# EAGLE design MJ808 clone - rev.5 - TCAN334 - prod (EAGLE 9.6.2)
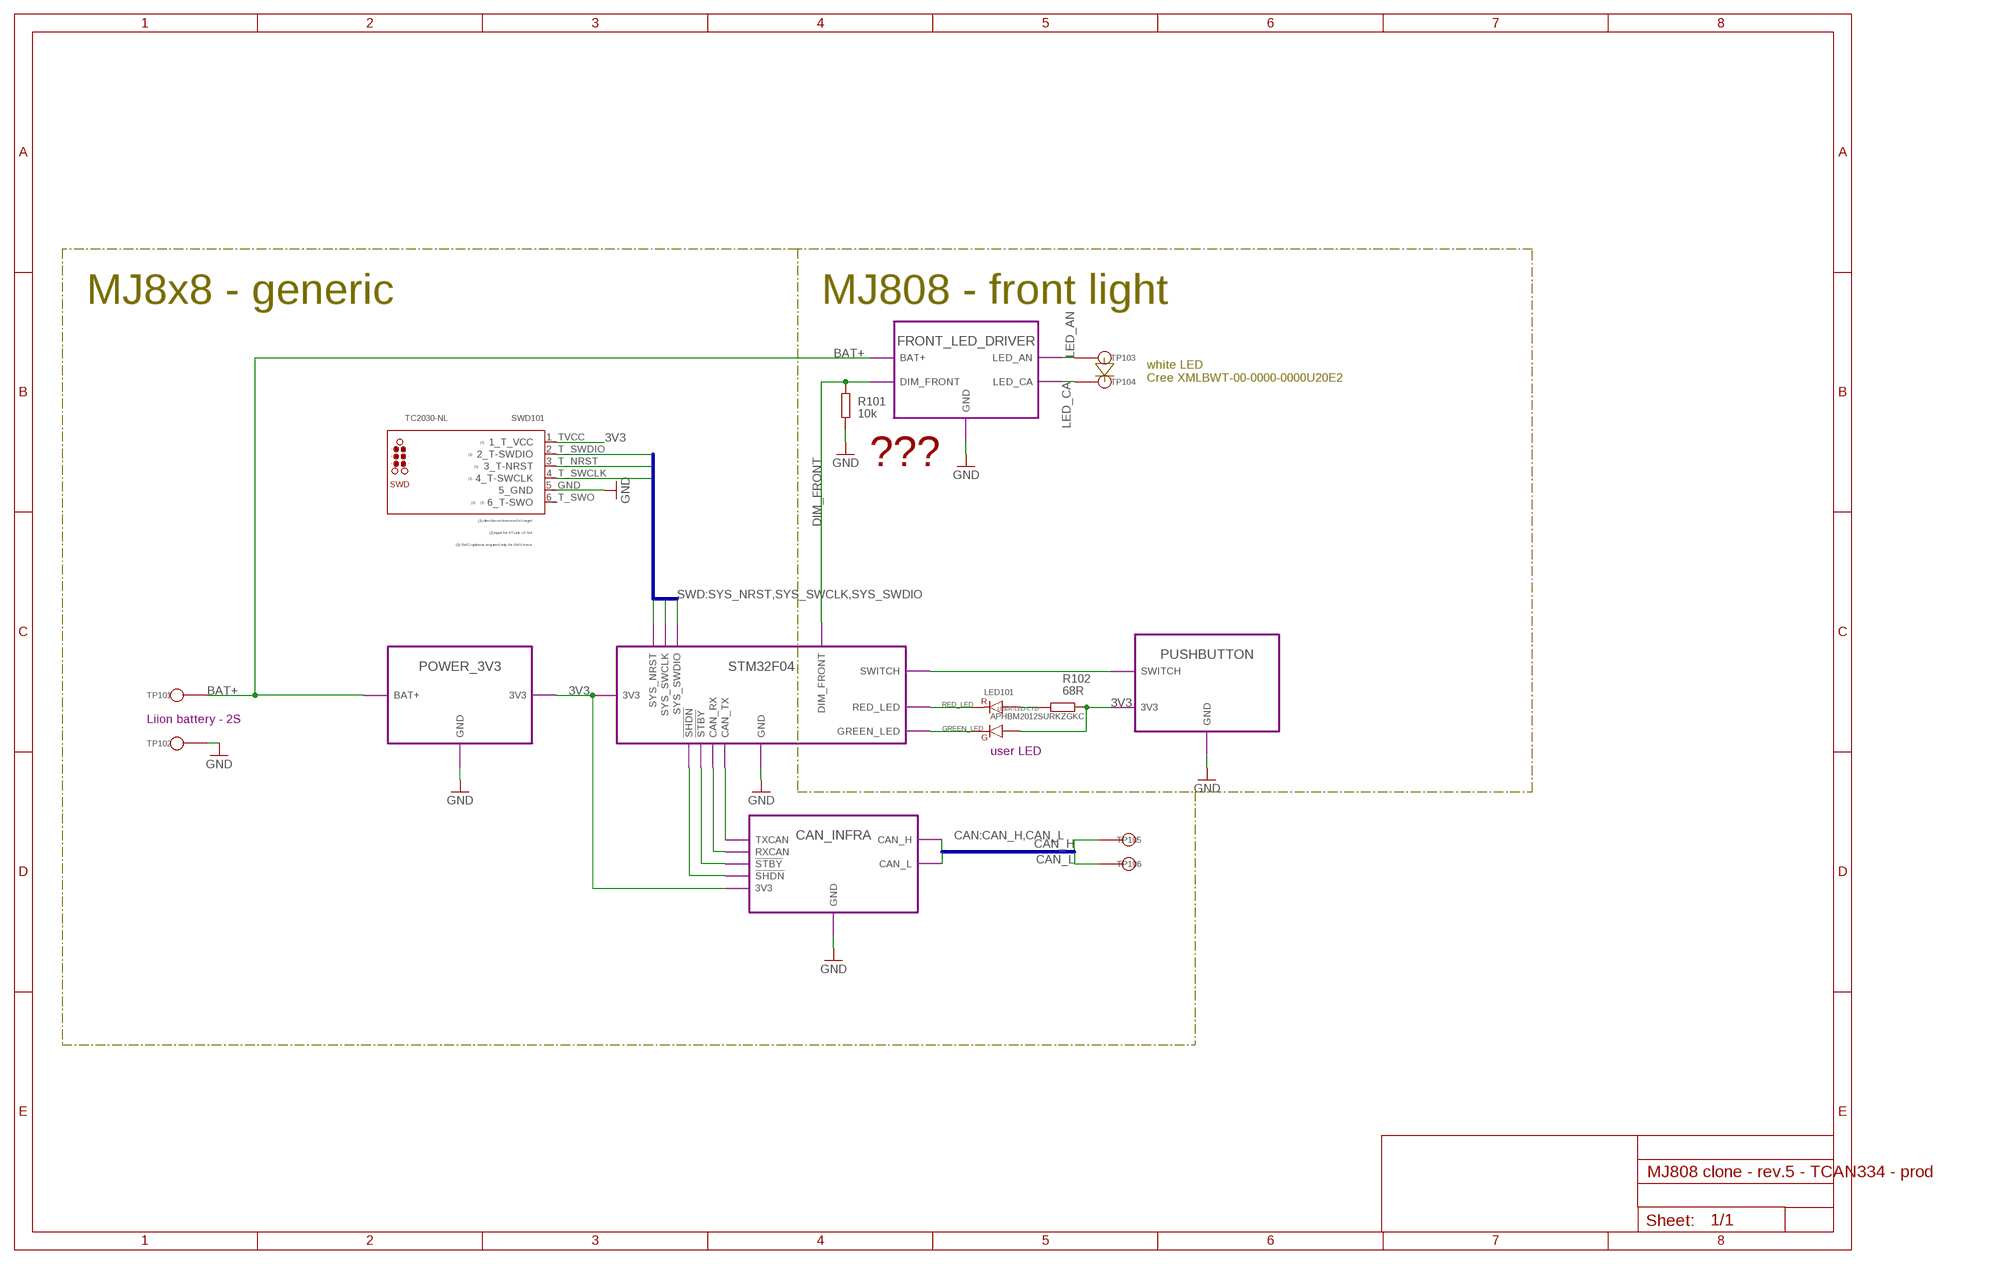
[diagram p0: schematic, sheet 1]

## Parts
LED101  APHBM2012SURKZGKC  APHBM2012LSURKZGKC  [SMD]
R101  10k  R-EU_R0402  [R0402]
R102  68R  R-EU_R0402  [R0402]
SWD101  TC2030-NL  TC2030  [TC2030-NL]
TP101  LiIon + Terminal  TP  [TH]
TP102  LiIon - Terminal  TP  [TH]
TP103  LED anode  TP  [TH]
TP104  LED cathode  TP  [TH]
TP105  CAN high  TP  [TH]
TP106  CAN low  TP  [TH]

## Module instances
POWER_3V3 = POWER_3V3 (part numbers offset by 200)
STM32F04 = STM32 (part numbers offset by 300)
CAN_INFRA = CAN_INFRA (part numbers offset by 400)
FRONT_LED_DRIVER = LED_DRIVER_FRONT (part numbers offset by 500)
PUSHBUTTON = PUSHBUTTON (part numbers offset by 600)

## Nets
3V3 [3V3]: LED101.4 R102.1 SWD101.1_TVCC(1_T_VCC) ; port POWER_3V3.3V3 STM32F04.3V3 CAN_INFRA.3V3 PUSHBUTTON.3V3
!SHDN!: port CAN_INFRA.!SHDN! STM32F04.!SHDN!
!STBY! [signal]: port CAN_INFRA.!STBY! STM32F04.!STBY!
BAT+ [BAT+]: TP101.TP$1 ; port POWER_3V3.BAT+ FRONT_LED_DRIVER.BAT+
CAN_H [signal]: TP105.TP$1 ; port CAN_INFRA.CAN_H
CAN_L [signal]: TP106.TP$1 ; port CAN_INFRA.CAN_L
CAN_RX [signal]: port CAN_INFRA.RXCAN STM32F04.CAN_RX
CAN_TX [signal]: port CAN_INFRA.TXCAN STM32F04.CAN_TX
DIM_FRONT [signal]: R101.2 ; port STM32F04.DIM_FRONT FRONT_LED_DRIVER.DIM_FRONT
GND: R101.1 SWD101.5_GND TP102.TP$1 ; port STM32F04.GND POWER_3V3.GND CAN_INFRA.GND FRONT_LED_DRIVER.GND PUSHBUTTON.GND
GREEN_LED [signal]: LED101.3 ; port STM32F04.GREEN_LED
LED_AN [BAT+]: TP103.TP$1 ; port FRONT_LED_DRIVER.LED_AN
LED_CA [BAT+]: TP104.TP$1 ; port FRONT_LED_DRIVER.LED_CA
RED_LED [signal]: LED101.2 ; port STM32F04.RED_LED
SWITCH: port STM32F04.SWITCH PUSHBUTTON.SWITCH
SYS_NRST [signal]: SWD101.3_T_NRST(3_T-NRST) ; port STM32F04.SYS_NRST
SYS_SWCLK [signal]: SWD101.4_T_SWCLK(4_T-SWCLK) ; port STM32F04.SYS_SWCLK
SYS_SWDIO [signal]: SWD101.2_T_SWDIO(2_T-SWDIO) ; port STM32F04.SYS_SWDIO
USER-LED-CTD [signal]: LED101.1 R102.2
Unconnected: SWD101.6_T_SWO(6_T-SWO)

## Buses
CAN:CAN_H,CAN_L
SWD:SYS_NRST,SYS_SWCLK,SYS_SWDIO

## Notes on the sheet
- MJ8x8 - generic | MJ808 - front light
- white LED
  Cree XMLBWT-00-0000-0000U20E2
- ???
- Liion battery - 2S
- user LED

## Library data of the parts
LED101 = APHBM2012LSURKZGKC:APHBM2012LSURKZGKC
R101 R102 = rcl:R-EU_: RESISTOR, European symbol; SPICEPREFIX: R
SWD101 = tag-connect:TC2030: TC2030 pad no. Function STLink v3 CN1 pin no. Function 1 Reserved (1) 2 Reserved (1) 1 T_Vcc 3 T_Vcc (2) 2 T_SWDIO 4 T_JTMS/T_SWDIO 5 GND 4 T_SWCLK 6 T_JCLK / T_SWCLK 5 GND 7 GND 6 8 T_JTDO / T_SWO (3) 9 T_JRCLK (4) / NC (5) 10 T_JTDI / NC (5) 11 GNDDetect (6) 3 T_NRST 12 T_NRST 13 T_VCP_RX (7) 14 T_VCP_TX (2) (1) Do not connect to the target (2) Input for STLINK-V3SET (3) SWO is optional, required only for Serial Wire Viewer (SWV) trace (4) Optional loopback of T_JCLK on the target side, required if loopback is removed on the STLINK-V3SET side (5) NC means not required for the SWD connection (6) Tied to GND by STLINK-V3SET firmware; may be used by the target for detection of the tool (7) Output for STLINK-V3SET
TP101-TP106 = signal testpoint:TP

## Module POWER_3V3
Ports: GND(pwr) BAT+(pwr) 3V3(pwr)
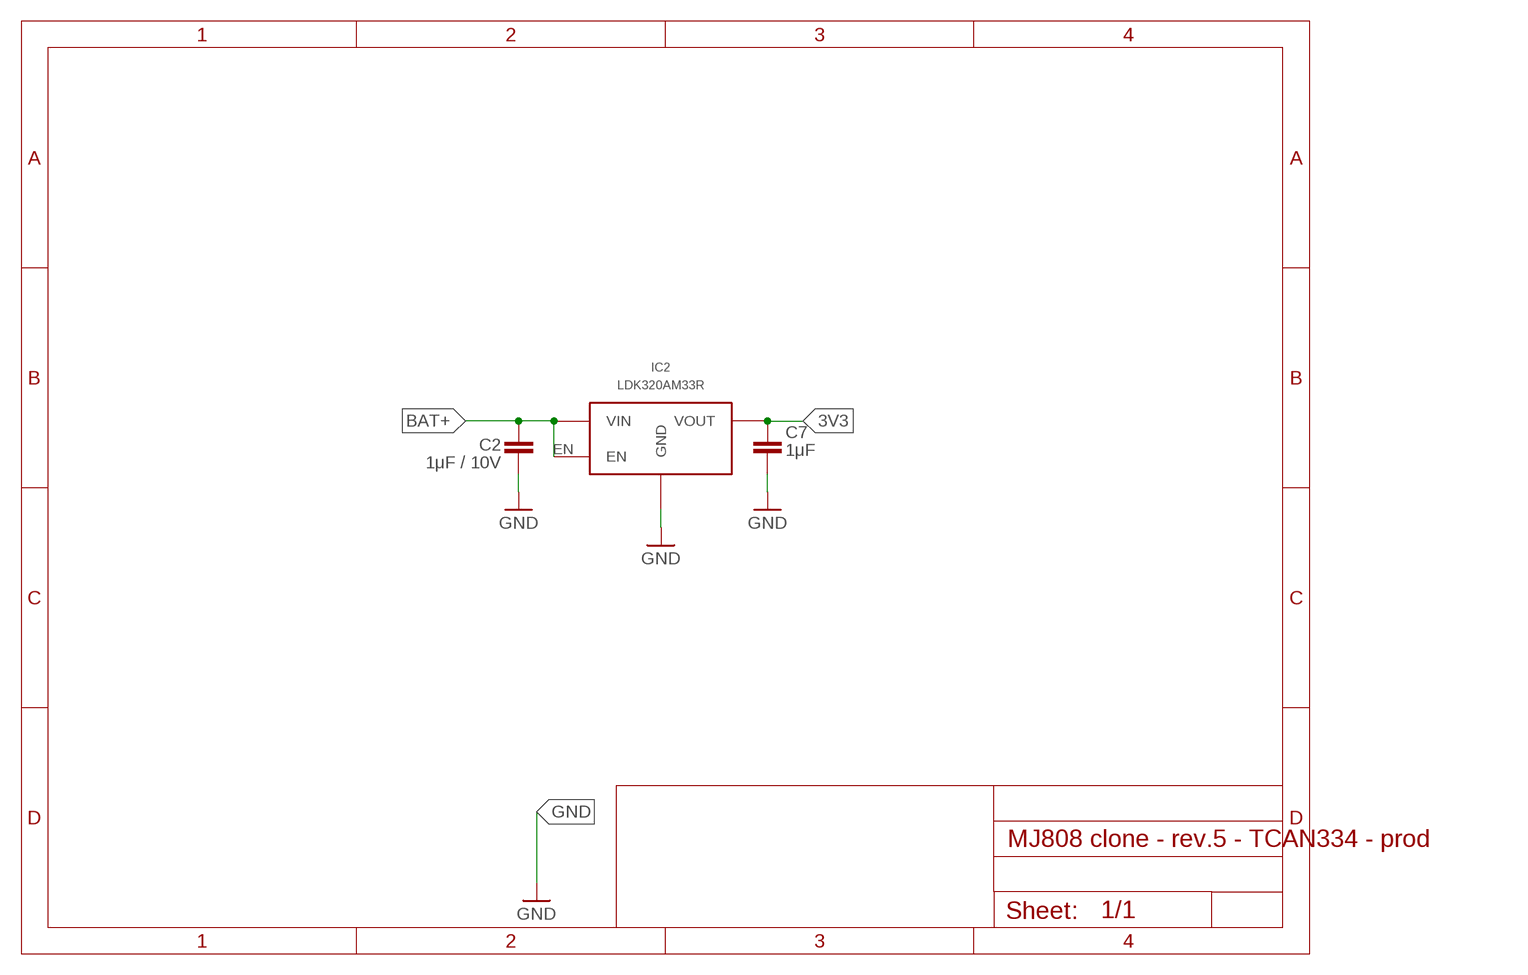
[diagram p1: schematic, module POWER_3V3, sheet 1]

### Parts
C2  1μF / 10V  C-EUC0402  [C0402]
C7  1μF  C-EUC0402  [C0402]
IC2  LDK320AM33R  LDK320SOT-23-5L  [SOT-23-5L]

### Nets
3V3 [3V3]: C7.2 IC2.OUT(VOUT)
BAT+ [BAT+]: C2.1 IC2.EN IC2.IN(VIN)
GND: C2.2 C7.1 IC2.GND

### Library data of the parts
C2 C7 = rcl:C-EU: CAPACITOR, European symbol; SPICEPREFIX: C
IC2 = LDK320 5V LDO:LDK320

## Module STM32
Ports: GND(pwr) 3V3(pwr) SYS_NRST(in) SYS_SWCLK(io) SYS_SWDIO(io) CAN_RX(in) CAN_TX(out) !STBY!(out) SWITCH(in) GREEN_LED(hiz) RED_LED(hiz) DIM_FRONT(out) !SHDN!(out)
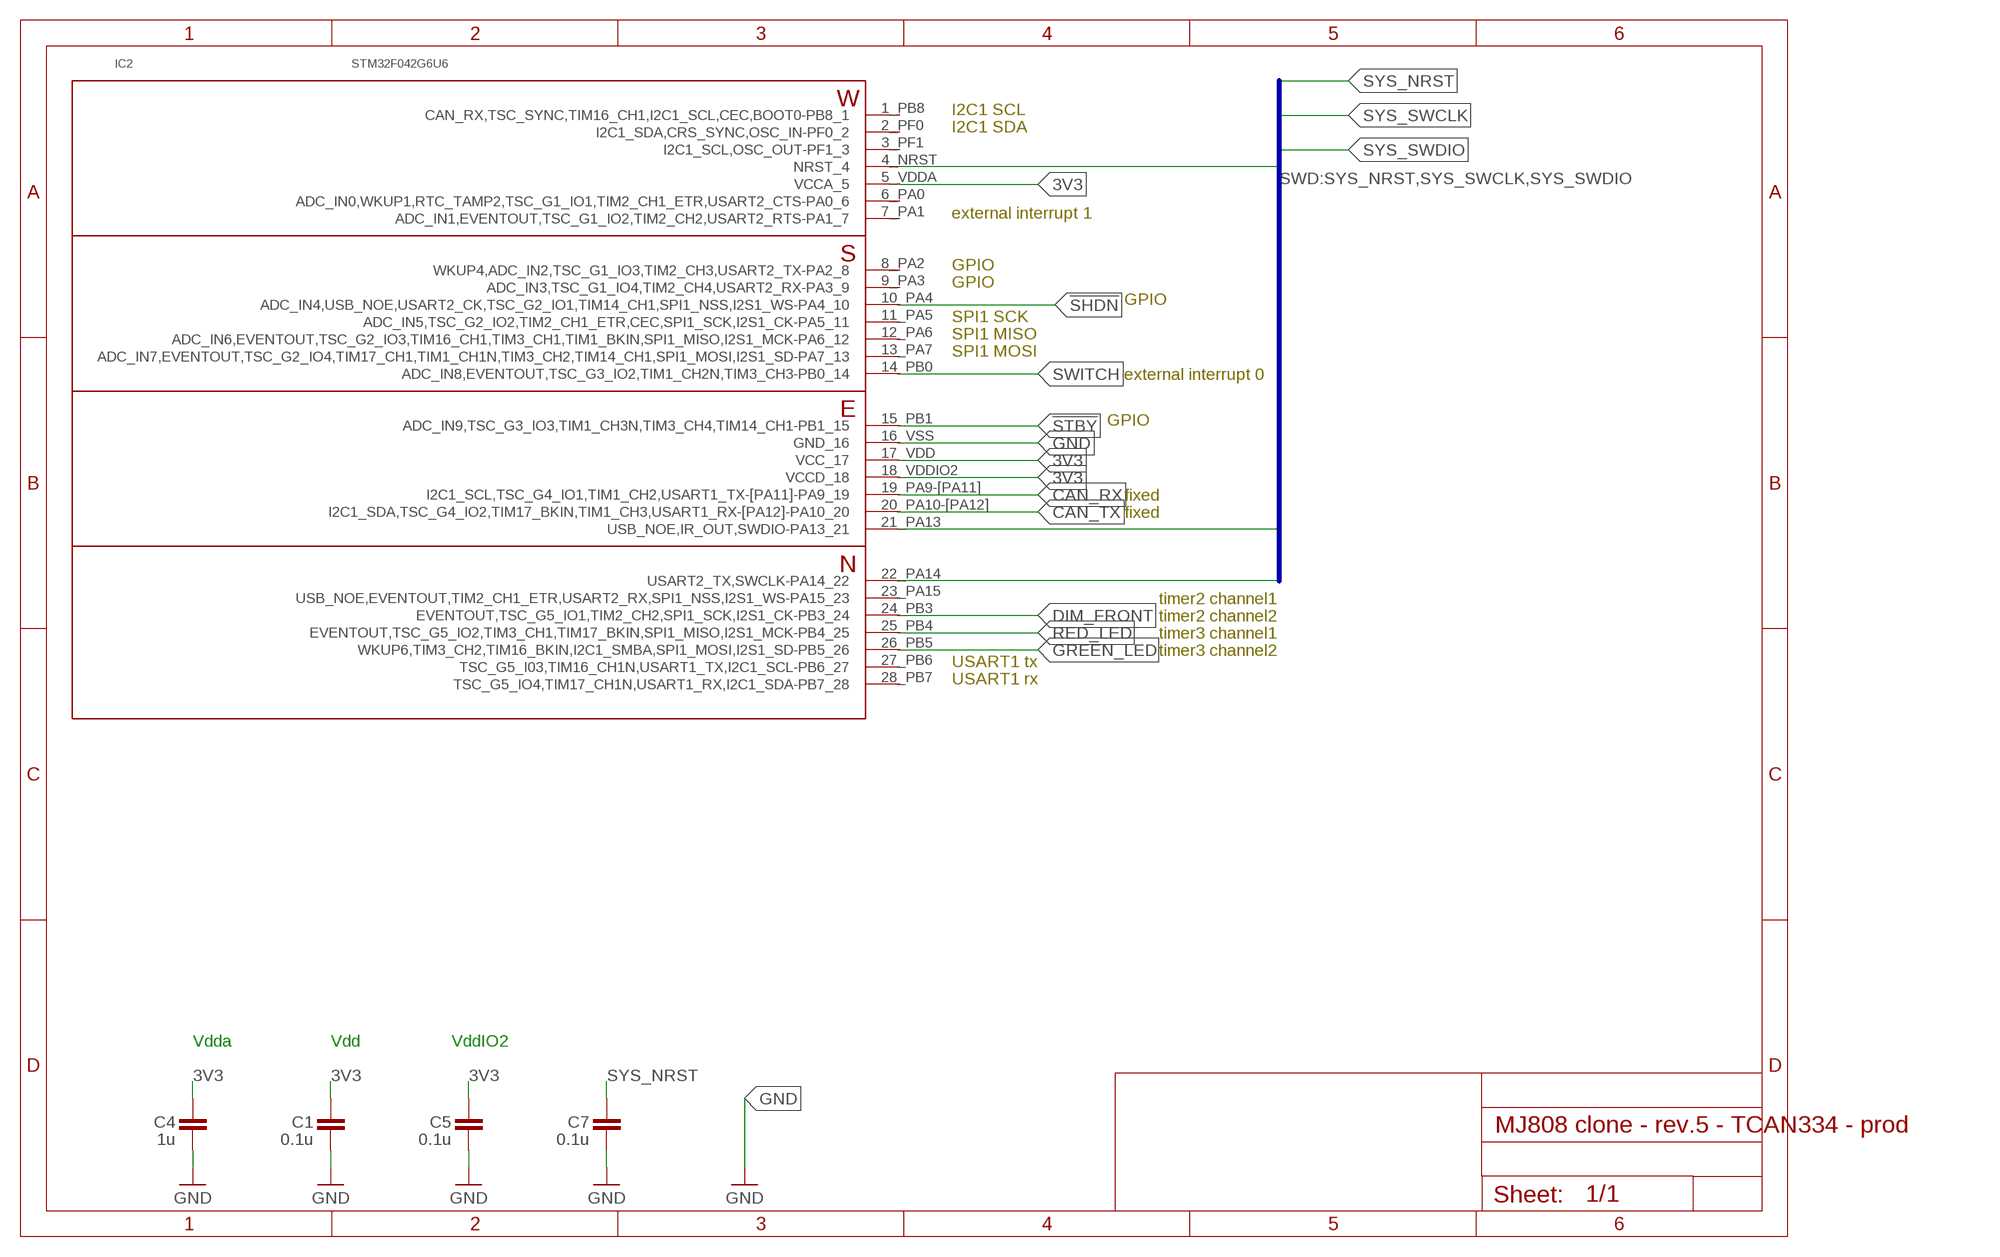
[diagram p2: schematic, module STM32, sheet 1]

### Parts
C1  0.1u  C-EUC0402  [C0402]
C4  1u  C-EUC0402  [C0402]
C5  0.1u  C-EUC0402  [C0402]
C7  0.1u  C-EUC0402  [C0402]
IC2  STM32F042G6U6  STM32F042G6  [UFQFPN-28]

### Nets
3V3 [3V3]: C1.2 C4.2 C5.2 IC2.5_VDDA(VCCA_5) IC2.17_VDD(VCC_17) IC2.18_VDDIO2(VCCD_18)
!SHDN!: IC2.10_PA4(ADC_IN4,USB_NOE,USART2_CK,TSC_G2_IO1,TIM14_CH1,SPI1_NSS,I2S1_WS-PA4_10)
!STBY!: IC2.15_PB1(ADC_IN9,TSC_G3_IO3,TIM1_CH3N,TIM3_CH4,TIM14_CH1-PB1_15)
CAN_RX: IC2.19_PA9-[PA11](I2C1_SCL,TSC_G4_IO1,TIM1_CH2,USART1_TX-[PA11]-PA9_19)
CAN_TX: IC2.20_PA10-[PA12](I2C1_SDA,TSC_G4_IO2,TIM17_BKIN,TIM1_CH3,USART1_RX-[PA12]-PA10_20)
DIM_FRONT: IC2.24_PB3(EVENTOUT,TSC_G5_IO1,TIM2_CH2,SPI1_SCK,I2S1_CK-PB3_24)
GND: C1.1 C4.1 C5.1 C7.1 IC2.16_VSS(GND_16)
GREEN_LED: IC2.26_PB5(WKUP6,TIM3_CH2,TIM16_BKIN,I2C1_SMBA,SPI1_MOSI,I2S1_SD-PB5_26)
RED_LED: IC2.25_PB4(EVENTOUT,TSC_G5_IO2,TIM3_CH1,TIM17_BKIN,SPI1_MISO,I2S1_MCK-PB4_25)
SWITCH: IC2.14_PB0(ADC_IN8,EVENTOUT,TSC_G3_IO2,TIM1_CH2N,TIM3_CH3-PB0_14)
SYS_NRST: C7.2 IC2.4_NRST(NRST_4)
SYS_SWCLK: IC2.22_PA14(USART2_TX,SWCLK-PA14_22)
SYS_SWDIO: IC2.21_PA13(USB_NOE,IR_OUT,SWDIO-PA13_21)
Unconnected: IC2.1_PB8(CAN_RX,TSC_SYNC,TIM16_CH1,I2C1_SCL,CEC,BOOT0-PB8_1) IC2.2_PF0(I2C1_SDA,CRS_SYNC,OSC_IN-PF0_2) IC2.3_PF1(I2C1_SCL,OSC_OUT-PF1_3) IC2.6_PA0(ADC_IN0,WKUP1,RTC_TAMP2,TSC_G1_IO1,TIM2_CH1_ETR,USART2_CTS-PA0_6) IC2.7_PA1(ADC_IN1,EVENTOUT,TSC_G1_IO2,TIM2_CH2,USART2_RTS-PA1_7) IC2.8_PA2(WKUP4,ADC_IN2,TSC_G1_IO3,TIM2_CH3,USART2_TX-PA2_8) IC2.9_PA3(ADC_IN3,TSC_G1_IO4,TIM2_CH4,USART2_RX-PA3_9) IC2.11_PA5(ADC_IN5,TSC_G2_IO2,TIM2_CH1_ETR,CEC,SPI1_SCK,I2S1_CK-PA5_11) IC2.12_PA6(ADC_IN6,EVENTOUT,TSC_G2_IO3,TIM16_CH1,TIM3_CH1,TIM1_BKIN,SPI1_MISO,I2S1_MCK-PA6_12) IC2.13_PA7(ADC_IN7,EVENTOUT,TSC_G2_IO4,TIM17_CH1,TIM1_CH1N,TIM3_CH2,TIM14_CH1,SPI1_MOSI,I2S1_SD-PA7_13) IC2.23_PA15(USB_NOE,EVENTOUT,TIM2_CH1_ETR,USART2_RX,SPI1_NSS,I2S1_WS-PA15_23) IC2.27_PB6(TSC_G5_I03,TIM16_CH1N,USART1_TX,I2C1_SCL-PB6_27) IC2.28_PB7(TSC_G5_IO4,TIM17_CH1N,USART1_RX,I2C1_SDA-PB7_28)

### Buses
SWD:SYS_NRST,SYS_SWCLK,SYS_SWDIO

### Notes on the sheet
- I2C1 SCL
- I2C1 SDA
- external interrupt 1
- GPIO
- GPIO
- GPIO
- SPI1 SCK
- SPI1 MISO
- SPI1 MOSI
- external interrupt 0
- GPIO
- fixed
- fixed
- timer2 channel1
- timer2 channel2
- timer3 channel1
- timer3 channel2
- USART1 tx
- USART1 rx
- Vdda | Vdd | VddIO2

### Library data of the parts
C1 C4 C5 C7 = rcl:C-EU: CAPACITOR, European symbol; SPICEPREFIX: C
IC2 = STM32F042G6:STM32F042G6

## Module CAN_INFRA
Ports: GND(pwr) 3V3(pwr) CAN_H(io) CAN_L(io) TXCAN(in) RXCAN(out) !STBY!(in) !SHDN!(in)
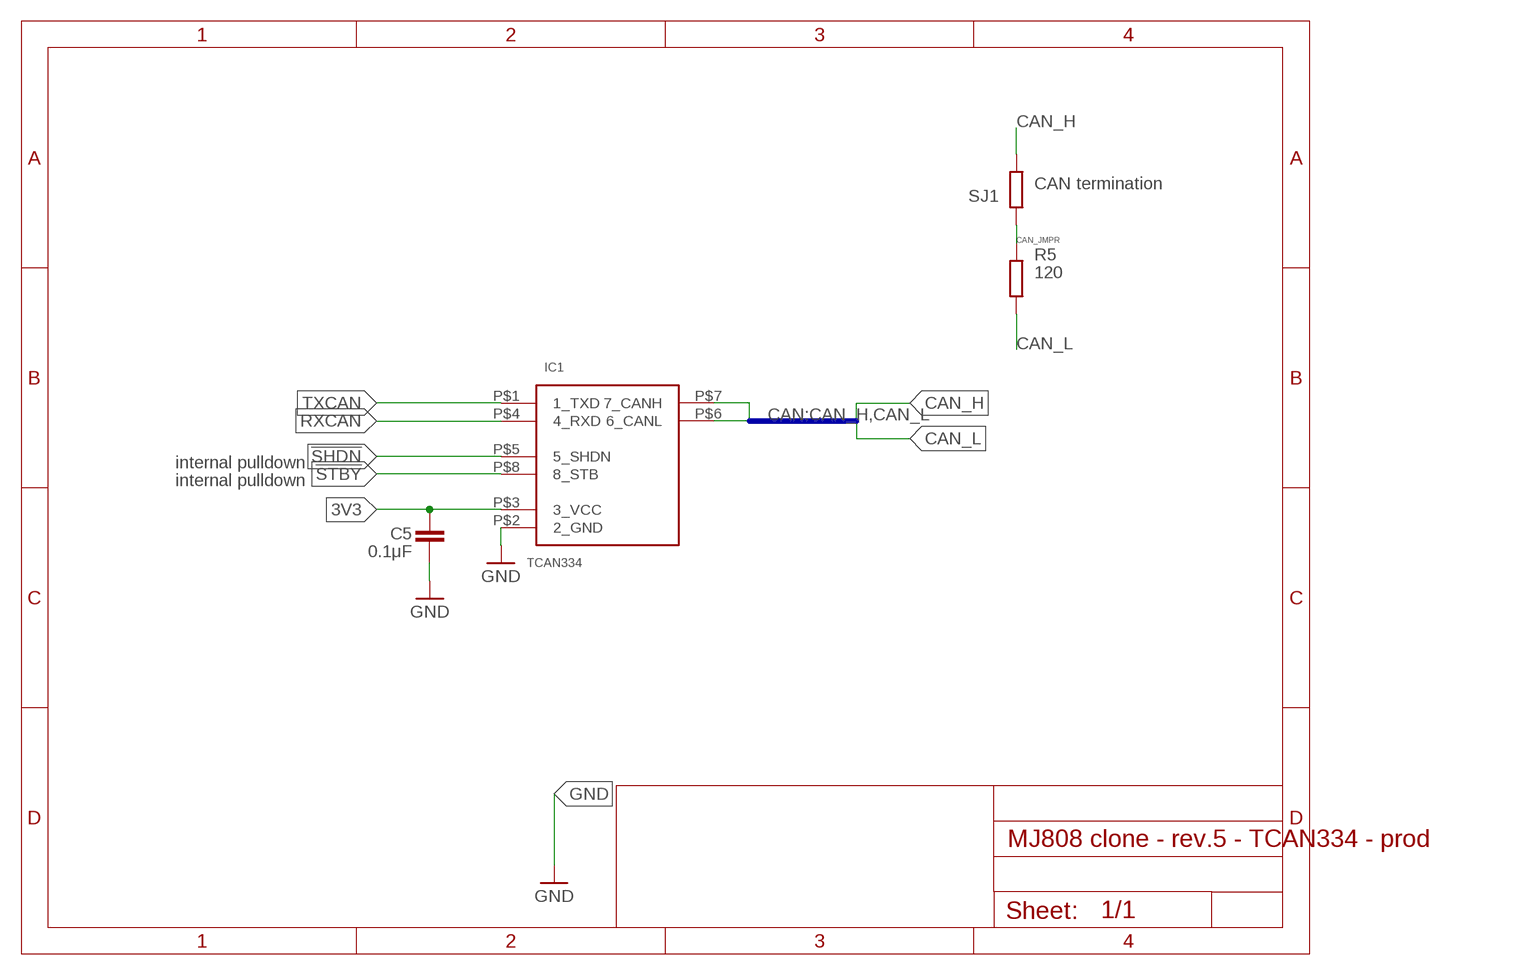
[diagram p3: schematic, module CAN_INFRA, sheet 1]

### Parts
C5  0.1μF  C-EUC0402  [C0402]
IC1  TCAN334  CAN33X  [SOT23-8]
R5  120  R-EU_R0805  [R0805]
SJ1  CAN termination  R-EU_R0402  [R0402]

### Nets
3V3 [3V3]: C5.1 IC1.P$3(3_VCC)
!SHDN!: IC1.P$5(5_SHDN)
!STBY! [signal]: IC1.P$8(8_STB)
CAN_H: IC1.P$7(7_CANH) SJ1.2
CAN_JMPR [signal]: R5.2 SJ1.1
CAN_L: IC1.P$6(6_CANL) R5.1
GND: C5.2 IC1.P$2(2_GND)
RXCAN [signal]: IC1.P$4(4_RXD)
TXCAN [signal]: IC1.P$1(1_TXD)

### Buses
CAN:CAN_H,CAN_L

### Notes on the sheet
- internal pulldown
- internal pulldown

### Library data of the parts
C5 = rcl:C-EU: CAPACITOR, European symbol; SPICEPREFIX: C
IC1 = TCAN33x - 3.3V CAN Transciever:CAN33X
R5 SJ1 = rcl:R-EU_: RESISTOR, European symbol; SPICEPREFIX: R

## Module LED_DRIVER_FRONT
Ports: GND(pwr) LED_AN(pwr) LED_CA(pwr) DIM_FRONT(in) BAT+(pwr)
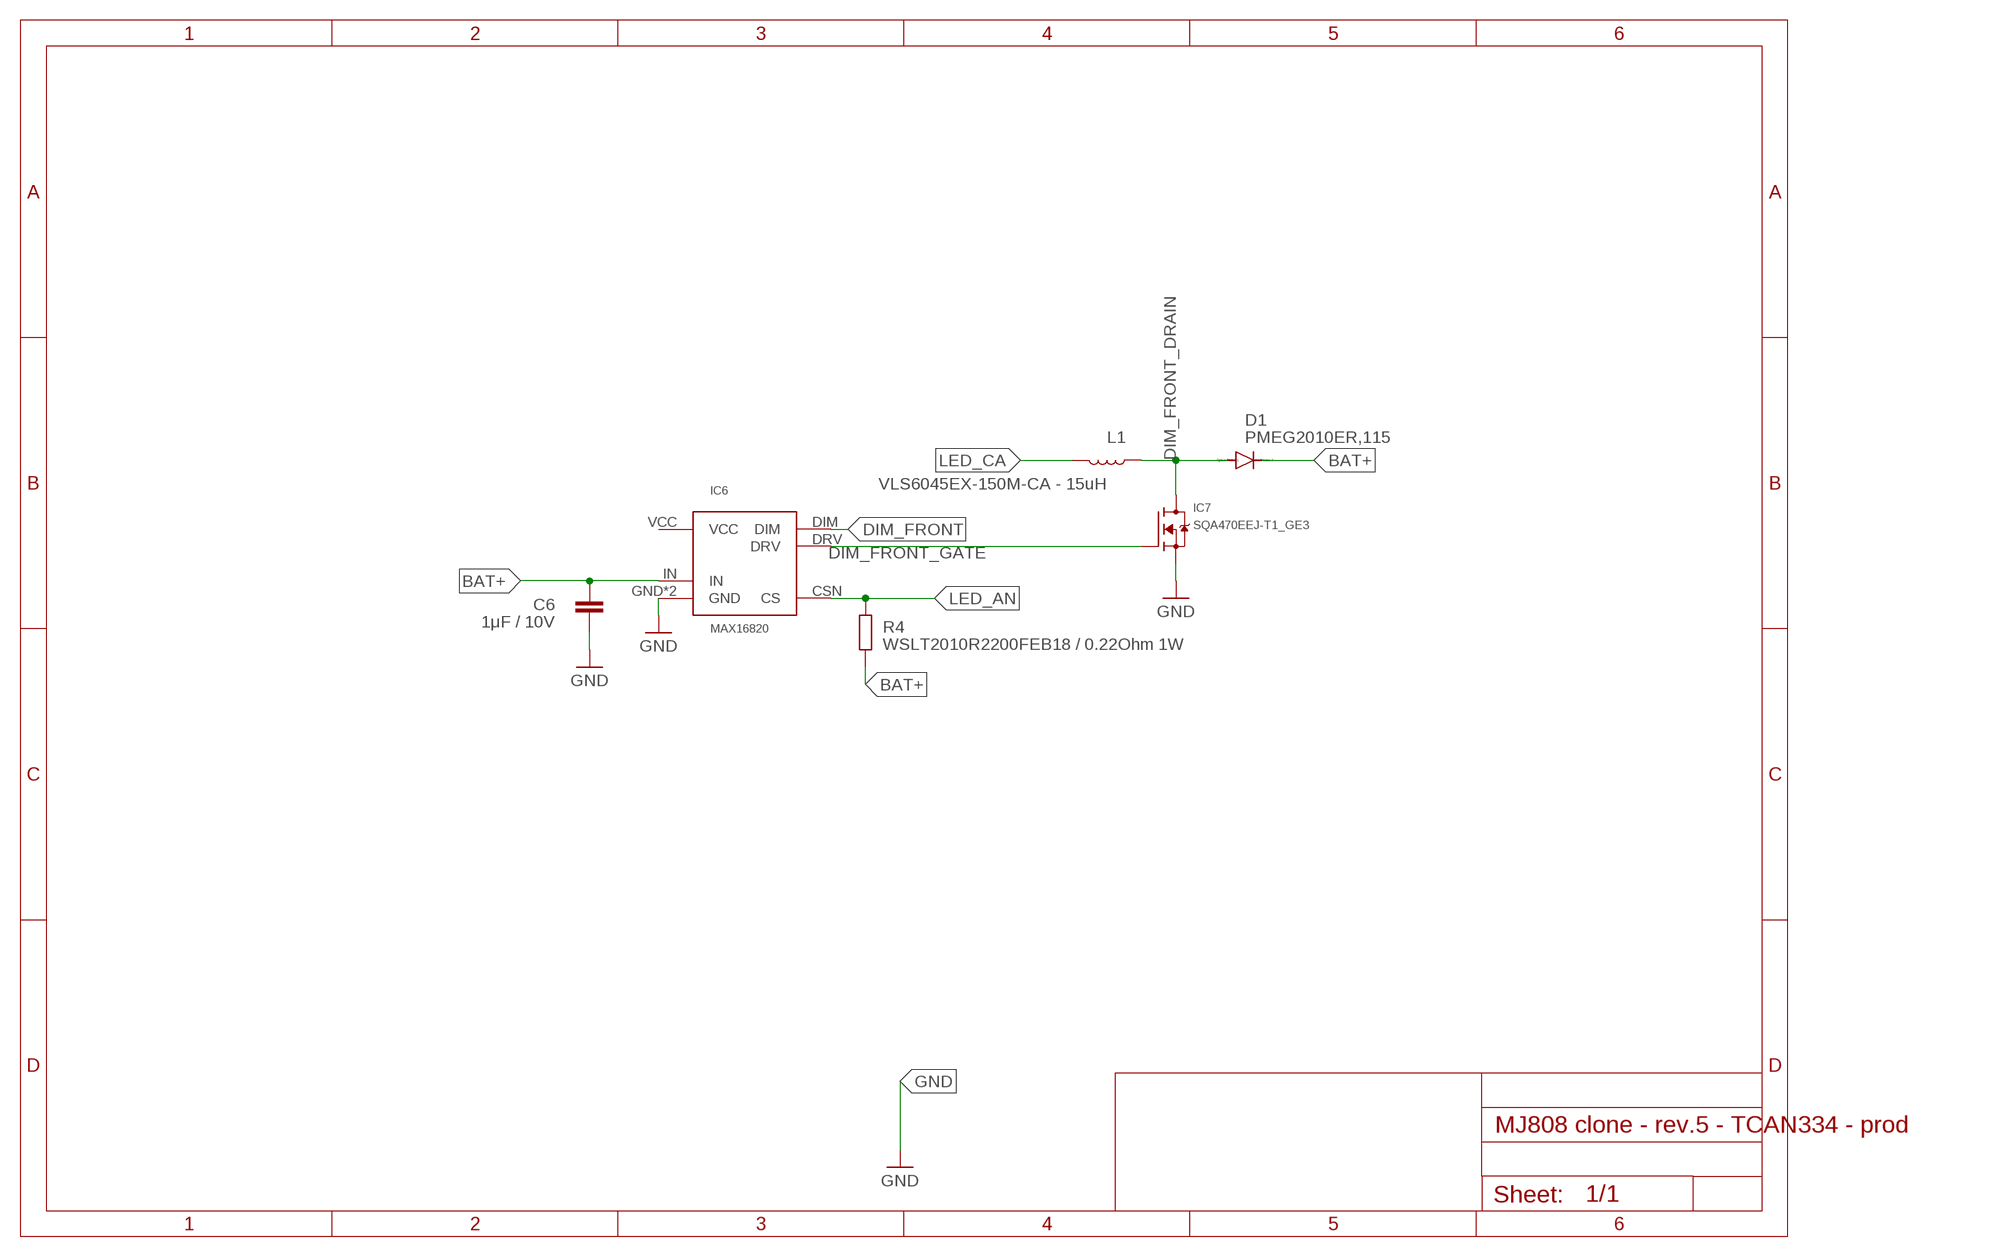
[diagram p4: schematic, module LED_DRIVER_FRONT, sheet 1]

### Parts
C6  1μF / 10V  C-EUC0402  [C0402]
D1  PMEG2010ER,115  DIODE-SOD123  [SOD123]
IC6  MAX16820  [TDFN-6-EP]
IC7  SQA470EEJ-T1_GE3  SIA456DJ  [SC-70-6]
L1  VLS6045EX-150M-CA - 15uH  INDUCTOR-SRN6045-33UH  [SRN6045]
R4  WSLT2010R2200FEB18 / 0.22Ohm 1W  R-EU_R2010  [R2010]

### Nets
BAT+ [BAT+]: C6.1 D1.C IC6.IN R4.2
DIM_FRONT [signal]: IC6.DIM
DIM_FRONT_DRAIN [signal]: D1.A IC7.1D(D) IC7.2D(D) IC7.5D(D) IC7.6D(D) IC7.D L1.1
DIM_FRONT_GATE [signal]: IC6.DRV IC7.3G(G)
GND: C6.2 IC6.GND IC6.GND1(GND) IC7.4S(S) IC7.S
LED_AN [BAT+]: IC6.CSN(CS) R4.1
LED_CA [BAT+]: L1.2

### Power pins joined to a net without a drawn wire
VCC: IC6.VCC

### Library data of the parts
C6 = rcl:C-EU: CAPACITOR, European symbol; SPICEPREFIX: C
D1 = diode:DIODE-: DIODE
IC6 = MAX16820 LED Driver, constant current:MAX16820
IC7 = SIA456DJ-T1-GE3  N-Fet:SIA456DJ
L1 = SparkFun-Coils:INDUCTOR: Inductors Resist changes in electrical current. Basically a coil of wire. SparkFun Products: SparkFun Load Cell Amplifier - HX711 <https://www.sparkfun.com/products/13879> IOIO-OTG - V2.2 <https://www.sparkfun.com/products/13613>; PROD_ID: NDUC-11627; VALUE: 33µH/±20%/1.4A
R4 = rcl:R-EU_: RESISTOR, European symbol; SPICEPREFIX: R

## Module PUSHBUTTON
Ports: SWITCH(out) GND(pwr) 3V3(pwr)
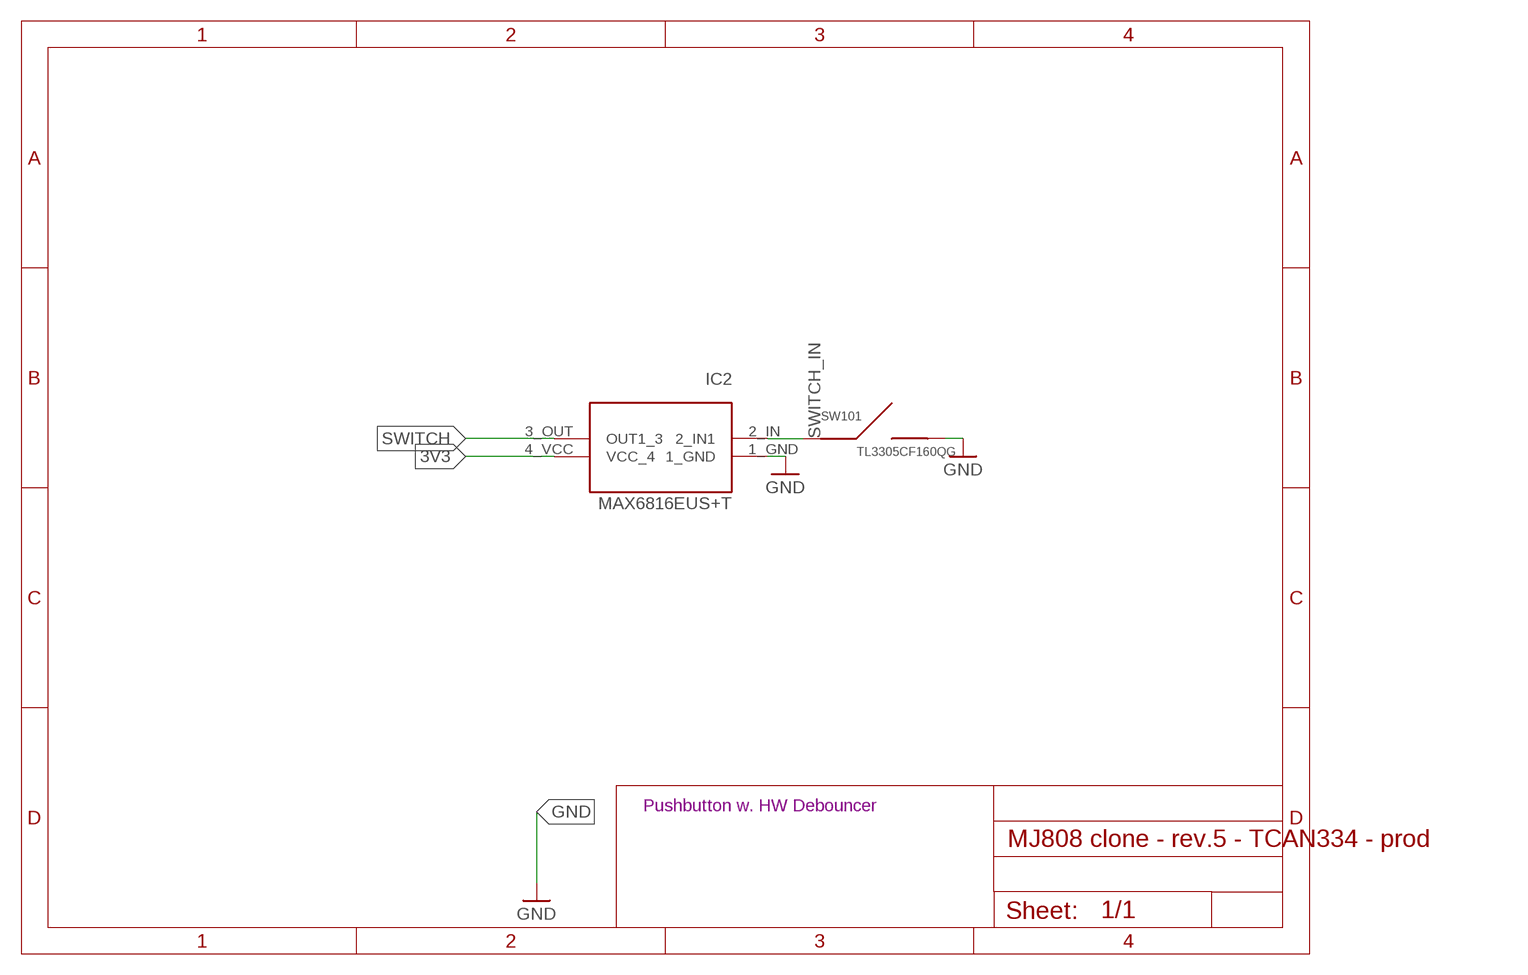
[diagram p5: schematic, module PUSHBUTTON, sheet 1]

### Parts
IC2  MAX6816EUS+T  MAX6816  [4SOT143]
SW101  TL3305CF160QG  TL3305-844809  [SMD]

### Nets
3V3: IC2.4_VCC(VCC_4)
GND: IC2.1_GND SW101.3 SW101.4
SWITCH: IC2.3_OUT(OUT1_3)
SWITCH_IN [3V3]: IC2.2_IN(2_IN1) SW101.1 SW101.2

### Notes on the sheet
- Pushbutton w. HW Debouncer

### Library data of the parts
IC2 = MAX6818 CMOS Switch debouncer:MAX6816
SW101 = TL3305-844809 SPST-NO Tact Switch:TL3305-844809

## Net classes
0 GND: width 0.25 mm, drill 0.35 mm, clearance 0.19 mm
1 BAT+: width 0.5 mm, drill 0.35 mm, clearance 0.19 mm
3 signal: width 0.25 mm, drill 0.35 mm, clearance 0.19 mm
4 3V3: width 0.25 mm, drill 0.35 mm, clearance 0.19 mm

## Board
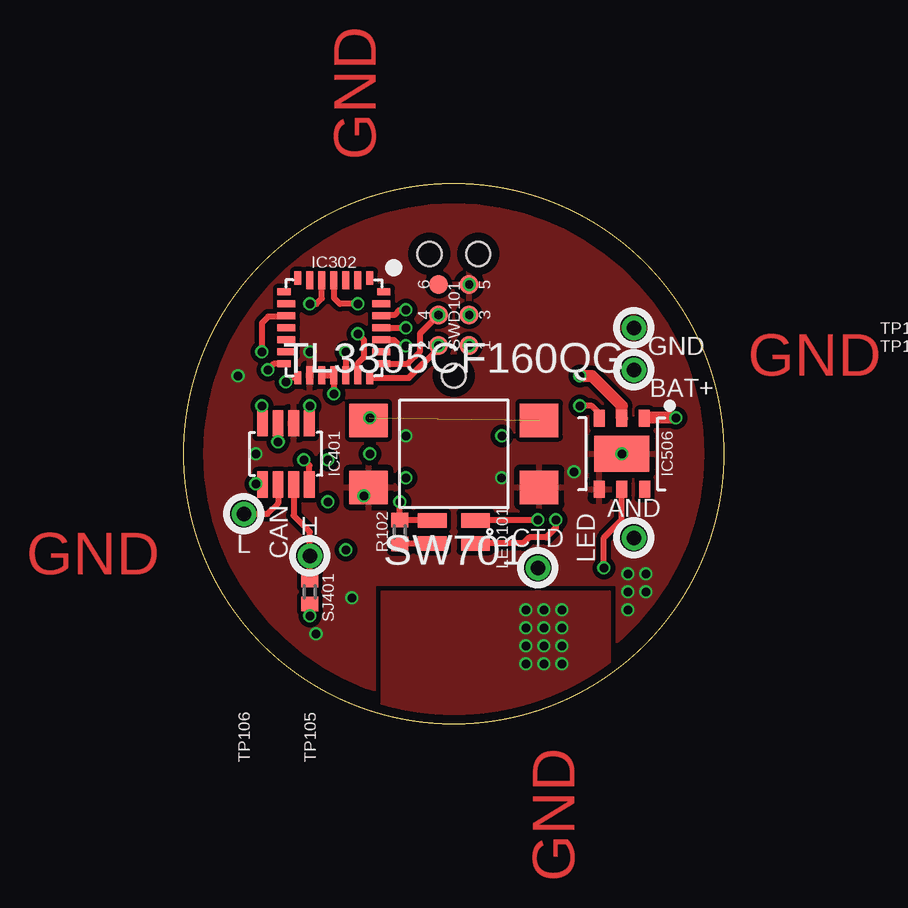
[diagram p6: board, top side]
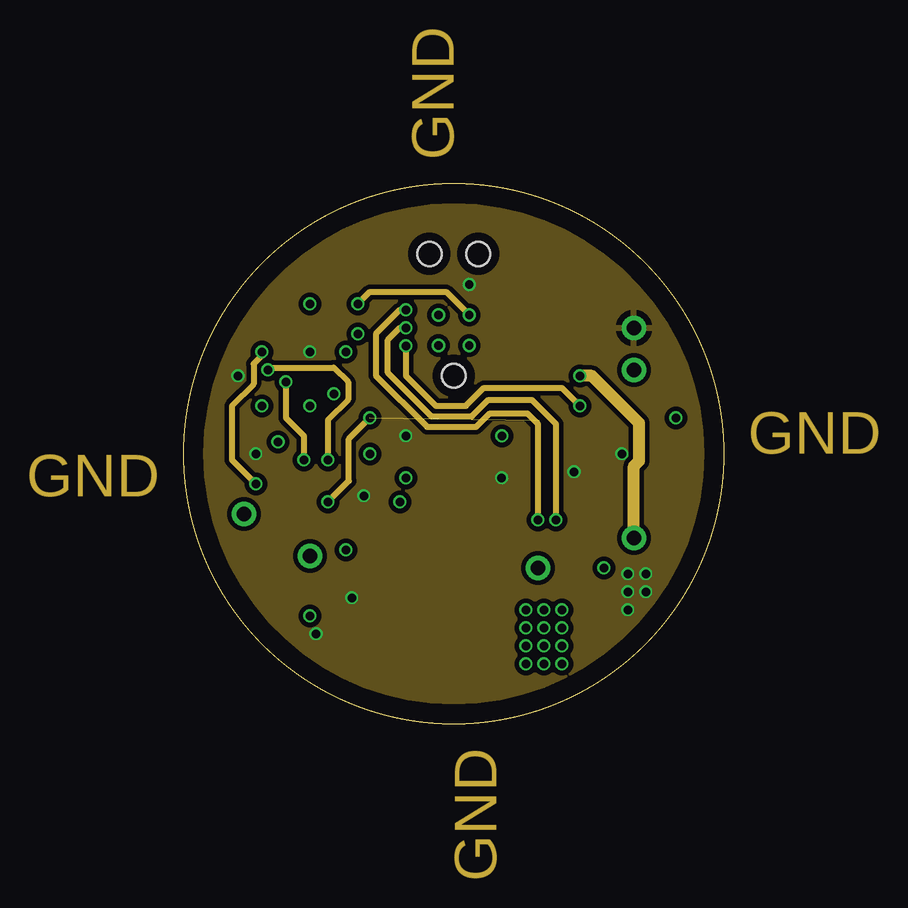
[diagram p7: board, inner layer Route2]
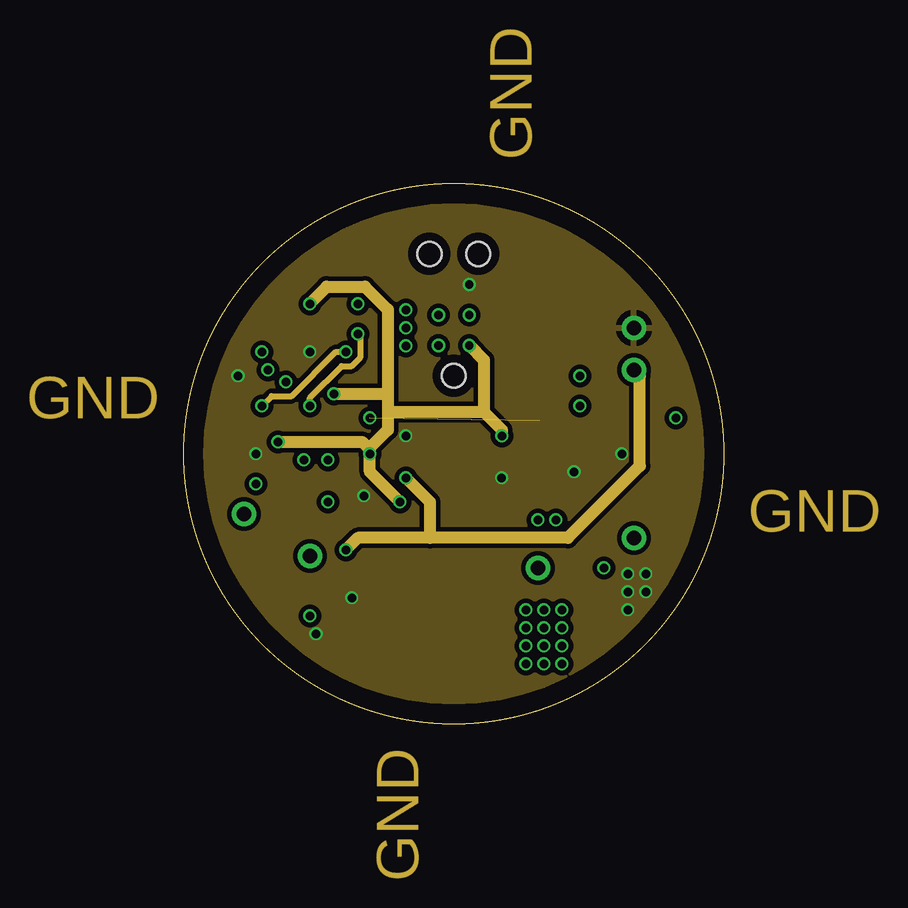
[diagram p8: board, inner layer Route15]
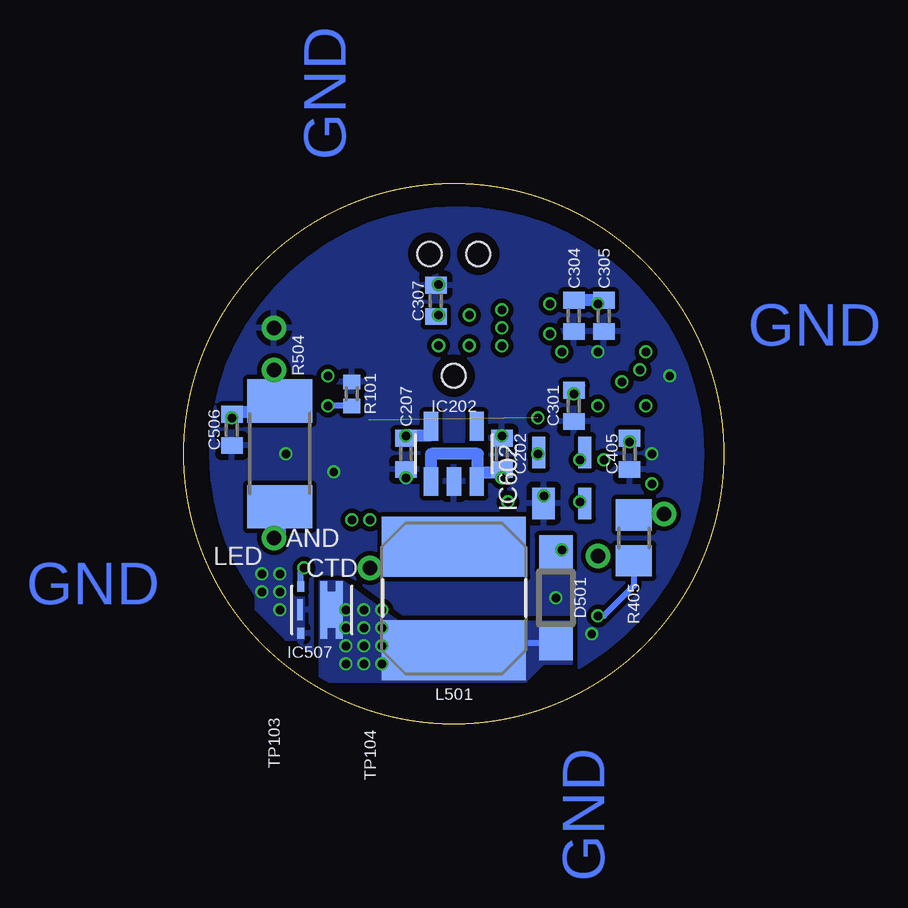
[diagram p9: board, bottom side, seen from below]

Size 22.5 x 22.5 mm. Coordinates in mm from the lower left corner, seen from the top.
Outline: circle at 11.25,11.25 radius 11.25
Copper layers (1*2*15*16): Top 0.035559375mm / dielectric 0.17018125mm / Route2 0.01778125mm / dielectric 47mil / Route15 0.01778125mm / dielectric 0.17018125mm / Bottom 0.035559375mm
Design rules "oshpark-4layer": minimum track width 5mil, minimum drill 10mil, track to track 5mil, track to pad 5mil, pad to pad 5mil, via to via 5mil, smd to smd 5mil, copper to edge 15mil, drill to drill 6mil, minimum pad ring 4mil, minimum via ring 4mil, stop-mask expansion 1.5mil, vias tented up to drill 0mil, thermal gap 10mil
bKeepout: area 0.5,0.5 to 22,22
tRestrict: 2 lines

### Footprints (pad centres in the part's own frame; a part is rotated, then mirrored left to right if it is on the bottom)
C0402 = smd 0.7 x 0.9: 1 -0.65,0; 2 0.65,0
SOD123 = smd 1.4 x 1.4: A 1.9,0; C -1.9,0
SOT-23-5L = smd 0.6 x 1.2: ADJ/NC -0.95,-1.15; EN -0.95,1.15; GND 0,1.15; IN 0.95,1.15; OUT 0.95,-1.15
UFQFPN-28 = smd 0.55 x 0.3: 1_PB8 -2.08,1.5; 7_PA1 -2.08,-1.5; 15_PB1 2.08,-1.5; 21_PA13 2.08,1.5 | smd 0.75 x 0.3: 2_PF0 -1.98,1; 3_PF1 -1.98,0.5; 4_NRST -1.98,0; 5_VDDA -1.98,-0.5; 6_PA0 -1.98,-1; 16_VSS 1.98,-1; 17_VDD 1.98,-0.5; 18_VDDIO2 1.98,0; 19_PA9-[PA11] 1.98,0.5; 20_PA10-[PA12] 1.98,1 | smd 0.3 x 0.55: 8_PA2 -1.5,-2.08; 14_PB0 1.5,-2.08; 22_PA14 1.5,2.08; 28_PB7 -1.5,2.08 | smd 0.3 x 0.75: 9_PA3 -1,-1.98; 10_PA4 -0.5,-1.98; 11_PA5 0,-1.98; 12_PA6 0.5,-1.98; 13_PA7 1,-1.98; 23_PA15 1,1.98; 24_PB3 0.5,1.98; 25_PB4 0,1.98; 26_PB5 -0.5,1.98; 27_PB6 -1,1.98
SOT23-8 = smd 0.45 x 1.1: P$1 -0.975,-1.275; P$2 -0.325,-1.275; P$3 0.325,-1.275; P$4 0.975,-1.275; P$5 0.975,1.275; P$6 0.325,1.275; P$7 -0.325,1.275; P$8 -0.975,1.275
TDFN-6-EP = smd 0.71 x 0.46: CSN -1.48,0; DIM -1.48,-0.94; DRV 1.48,0; GND1 1.48,-0.95; IN -1.48,0.94; VCC 1.48,0.95 | smd 1.5 x 2.3: GND 0,0
SC-70-6 = smd 0.45 x 0.3: 1D -0.975,0.725; 2D -0.975,0.075; 3G -0.975,-0.88; 4S 0.975,-0.88; 5D 0.975,0.075; 6D 0.975,0.725 | smd 1.5 x 0.95: D 0,0.4 | smd 0.87 x 0.23: S 0,-0.915
4SOT143 = smd 0.94 x 1.31: 1_GND -0.76,-1.06 | smd 0.55 x 1.31: 2_IN 0.96,-1.06; 3_OUT 0.96,1.06; 4_VCC -0.96,1.06
SRN6045 = smd 2.5 x 6: 1 -2.175,0; 2 2.125,0
SMD = smd 1.2 x 0.6: 1 0.9,0.48; 2 -0.9,0.48; 3 -0.9,-0.48; 4 0.9,-0.48
R0402 = smd 0.6 x 0.7: 1 -0.5,0; 2 0.5,0
R0805 = smd 1.3 x 1.5: 1 -0.95,0; 2 0.95,0
R2010 = smd 1.8 x 2.7: 1 -2.2,0; 2 2.2,0
SMD' = smd 1.6 x 1.4: 1 -3.556,-1.397; 2 3.556,-1.397; 3 -3.556,1.397; 4 3.556,1.397
TC2030-NL = smd 0.787 x 0.787: 1_TVCC 1.27,-0.635; 2_T_SWDIO 1.27,0.635; 3_T_NRST 2.54,-0.635; 4_T_SWCLK 2.54,0.635; 5_GND 3.81,-0.635; 6_T_SWO 3.81,0.635 | hole 0.991: 0,0; 5.08,-1.016; 5.08,1.016
TH = drill 0.6 pad 1.016: TP$1 0,0

### Placement (x,y rotation side)
C202  1μF / 10V  [C0402]  9.25,11.25 90 bottom
C207  1μF  [C0402]  13.24,11.25 90 bottom
C301  0.1u  [C0402]  6.25,13.25 90 bottom
C304  1u  [C0402]  6.25,17 90 bottom
C305  0.1u  [C0402]  5,17 90 bottom
C307  0.1u  [C0402]  12,17.62 270 bottom
C405  0.1μF  [C0402]  3.92,11.25 270 bottom
C506  1μF / 10V  [C0402]  20.5,12.25 270 bottom
D501  PMEG2010ER,115  [SOD123]  7,5.25 270 bottom
IC202  LDK320AM33R  [SOT-23-5L]  11.25,11.25 180 bottom
IC302  STM32F042G6U6  [UFQFPN-28]  6.25,16.5 270 top
IC401  TCAN334  [SOT23-8]  4.25,11.25 180 top
IC506  MAX16820  [TDFN-6-EP]  18.25,11.25 270 top
IC507  SQA470EEJ-T1_GE3  [SC-70-6]  16.75,4.75 270 bottom
IC602  MAX6816EUS+T  [4SOT143]  6.75,10.25 0 bottom
L501  VLS6045EX-150M-CA - 15uH  [SRN6045]  11.25,5.25 90 bottom
LED101  11.25,8 180 top
R101  15.5,13.75 270 bottom
R102  9,8 270 top
R405  120  [R0805]  3.75,7.75 270 bottom
R504  WSLT2010R2200FEB18 / 0.22Ohm 1W  [R2010]  18.5,11.25 90 bottom
SJ401  CAN termination  [R0402]  5.25,5.5 90 top
SW701  TL3305CF160QG  [SMD']  11.25,11.25 180 top
SWD101  11.25,14.5 90 top
TP101  18.75,14.75 0 top
TP102  18.75,16.5 0 top
TP103  18.75,7.75 0 top
TP104  14.75,6.5 0 top
TP105  5.25,7 0 top
TP106  2.5,8.75 0 top

### Tracks (layer width: path | path; a pad name or v marks a point on that pad's centre or on a via)
3V3  (via drill 0.35)
  Top 0.25: IC302.17_VDD IC302.18_VDDIO2 v6.25,13.75 | LED101.4 9.02,8.48 R102.1 v9,9.25 | SWD101.1_TVCC | v5.25,17.5 5.52,17.5 5.75,17.73 IC302.5_VDDA | v3.92,11.75 IC401.P$3
  Route15 0.5: 8.5,13.75 8.5,17.26 7.55,18.22 5.95,18.22 5.25,17.51 v5.25,17.5 | 8.5,13.75 8.5,13 | 8.5,13 12.5,13 | 12.5,13 13.25,12.25 v13.25,12 | SWD101.1_TVCC 12.5,15.16 12.5,13 | v6.25,13.75 8.5,13.75 | v9,9.25 7.75,10.5 v7.75,11.25 7.75,11.5 | 7.75,11.5 7.67,11.5 7.42,11.75 v3.92,11.75 | 8.5,13 8.5,12.25 7.75,11.5
  Bottom 0.25: v6.25,13.75 5.9,14.1 C301.2 | v13.24,11.99 v13.25,12 | C405.1 v3.92,11.75 | IC602.4_VCC 7.75,11.27 v7.75,11.25
  Bottom 0.5: C304.2 5.4,17.65 v5.25,17.5 5.1,17.65 C305.2 | IC202.OUT 12.2,12.04 13.11,12.04 C207.2 v13.24,11.99
  other vias: 11.89,15.77
!SHDN!  (via drill 0.35)
  Top 0.25: IC401.P$5 3.25,10 v3,10 | IC302.10_PA4 4.24,16.96 3.51,16.96 3.25,16.7 v3.25,15.5
  Route2 0.25: v3,10 2,11 2,13.25 2.91,14.16 2.91,15 3.25,15.34 v3.25,15.5
!STBY!  (via drill 0.35)
  Top 0.25: IC401.P$8 5.22,10.78 v5,11 | IC302.15_PB1 4.25,14.42 v4.25,14.25
  Route2 0.25: v5,11 5,12 4.25,12.75 v4.25,14.25
BAT+  (via drill 0.35)
  Top 0.5: IC506.IN 19.21,12.75 v20.5,12.75
  Route15 0.5: v9.25,10.25 10.25,9.25 10.25,7.75 | 10.25,7.75 7.25,7.75 v6.75,7.25 | 10.25,7.75 16,7.75 19,10.75 19,14.5 TP101.TP$1
  Bottom 0.5: 10.25,10.47 10.25,10.15 IC202.EN | IC202.IN 12.2,11.25 10.25,11.25 10.25,10.47 | 10.25,10.47 9.38,10.47 C202.1 v9.25,10.25 | D501.C 6.9,7.25 v6.75,7.25 | TP101.TP$1 18.75,13.5 18.5,13.25 R504.2 18.95,13 20.25,13 v20.5,12.75 C506.1
CAN_H
  Top 0.25: SJ401.2 TP105.TP$1 5.25,8 4.58,8.68 IC401.P$7
CAN_INFRA:CAN_JMPR  (via drill 0.35)
  Top 0.25: SJ401.1 v5.25,4.5
  Bottom 0.25: v5.25,4.5 5,4.5 3.75,5.75 R405.2
CAN_L
  Top 0.25: TP106.TP$1 3.47,8.75 3.92,9.2 IC401.P$6
  Bottom 0.25: R405.1 3.7,8.75 TP106.TP$1
CAN_RX  (via drill 0.35)
  Top 0.25: v3.25,13.25 3.28,13.22 IC401.P$4 | v6.75,15.5 IC302.19_PA9-[PA11]
  Route15 0.25: v3.25,13.25 3.66,13.66 4.5,13.66 6.34,15.5 v6.75,15.5
CAN_TX  (via drill 0.35)
  Top 0.25: v7.25,16.25 7.5,16 7.5,15.27 7.25,15.02 IC302.20_PA10-[PA12] | IC401.P$1 5.22,12.72 5.25,12.75 5.2,12.8 5.25,12.85 v5.25,13.25
  Route15 0.25: v5.25,13.25 5.25,13.59 6.57,14.91 7,14.91 7.34,15.25 7.34,16.16 v7.25,16.25
DIM_FRONT  (via drill 0.35)
  Top 0.25: IC506.DIM 17.31,12.94 17,13.25 v16.5,13.25 | IC302.24_PB3 8.75,16 9,15.75 v9.25,15.75
  Route2 0.25: v9.25,15.75 9.25,14.5 10.5,13.25 11.75,13.25 12.5,14 15.75,14 v16.5,13.25
  Bottom 0.25: R101.2 v16.5,13.25
FRONT_LED_DRIVER:DIM_FRONT_DRAIN  (via drill 0.35)
  Bottom 0.25: D501.A 10.97,3.35 L501.1
  other vias: 15,4.75 15,4 15,3.25 15,2.5 15.75,2.5 14.25,2.5 14.25,3.25 14.25,4 15.75,3.25 15.75,4 15.75,4.75 14.25,4.75
  pour Bottom (isolate 0.254, rank 2, no thermals): 6.33,2.5 6.33,4.25 13.57,4.25 15.87,5.93 16.84,5.93 16.84,1.75 8.25,1.75 7.5,2.5
  pour Top (isolate 0.254, rank 2, no thermals): 8.25,5.5 17.75,5.5 17.75,-0.12 8.25,-0.12
FRONT_LED_DRIVER:DIM_FRONT_GATE  (via drill 0.35)
  Top 0.25: v17.5,6.5 17.5,7.75 18.25,8.5 IC506.DRV
  Bottom 0.25: IC507.3G 17.63,6.37 v17.5,6.5
GND  (via drill 0.35)
  other vias: 11.89,18.31 5.25,15.5 18.25,11.25 3,11.25 18.5,4.75 13.24,10.25 16.25,10.5 9.25,12 18.5,5.5 18.5,6.25 19.25,6.25 19.25,5.5 7,5.25 2.25,14.5 5.5,3.75 7.5,9.5
  pour Top (rank 3): 0.88,11.25 arc-90 11.25,21.62 arc-90 21.62,11.25 arc-90 11.25,0.88 arc-90
  pour Bottom (rank 3): 0.88,11.25 arc-90 11.12,21.5 arc-90 21.38,11.25 arc-90 11.12,1 arc-90
  pour Route2: 0.88,11.25 arc-90 11.25,21.62 arc-90 21.62,11.25 arc-90 11.25,0.88 arc-90
  pour Bottom (no thermals): 17.5,6.75 17.5,3.5 18.25,3.5 19.5,4.75 19.5,6.75
  pour Route15: 0.88,11.25 arc-90 11.25,21.62 arc-90 21.62,11.25 arc-90 11.25,0.88 arc-90
GREEN_LED  (via drill 0.35)
  Top 0.25: LED101.3 12.17,8.5 v14.75,8.5 | IC302.26_PB5 8.27,17.04 8.79,17.04 9,17.25 v9.25,17.25
  Route2 0.25: v9.25,17.25 9,17.25 8,16.25 8,14.5 10.13,12.37 12.18,12.37 12.75,12.94 14.31,12.94 14.75,12.5 v14.75,8.5
LED_AN  (via drill 0.35)
  Top 0.5: IC506.CSN 18.25,13.25 17,14.5 v16.5,14.5
  Route2 0.5: TP103.TP$1 18.75,10.74 18.97,10.95 18.97,12.53 17,14.5 v16.5,14.5
  Bottom 0.5: R504.1 18.5,8 TP103.TP$1
LED_CA
  Bottom 0.5: TP104.TP$1 12.12,6.5 L501.2
PUSHBUTTON:SWITCH_IN  (via drill 0.35)  (1 unrouted)
  Top 0.25: SW701.2 7.69,12.69 v7.75,12.75
  Route2 0.25: v7.75,12.75 6.88,11.88 6.88,10.12 v6,9.25
  Bottom 0.25: IC602.2_IN 5.85,9.25 v6,9.25
RED_LED  (via drill 0.35)
  Top 0.25: v15.5,8.5 15.5,8.16 15.11,7.77 14.4,7.77 14.15,7.52 LED101.2 | IC302.25_PB4 v9.25,16.5
  Route2 0.25: v9.25,16.5 9,16.5 8.5,16 8.5,14.63 10.32,12.81 12,12.81 12.69,13.5 14.5,13.5 15.5,12.5 v15.5,8.5
SWITCH  (via drill 0.35)
  Top 0.25: IC302.14_PB0 3.75,15 v3.5,14.75
  Route2 0.25: v6,11 6,12.66 6.84,13.5 6.84,14.25 6.25,14.84 3.59,14.84 v3.5,14.75
  Bottom 0.25: IC602.3_OUT 6,11.1 v6,11
SYS_NRST  (via drill 0.35)
  Top 0.25: SWD101.3_T_NRST | v7.25,17.5 6.5,17.5 6.25,17.75 IC302.4_NRST
  Route2 0.25: v7.25,17.5 7.75,18 10.93,18 SWD101.3_T_NRST
  Bottom 0.25: C307.2 11.94,17.04 SWD101.3_T_NRST
  other vias: 11.89,17.04
SYS_SWCLK  (via drill 0.35)
  Top 0.25: v10.61,17.04 SWD101.4_T_SWCLK 9.84,16.27 9.84,15.5 9.34,15 IC302.22_PA14
SYS_SWDIO  (via drill 0.35)
  Top 0.25: SWD101.2_T_SWDIO 10.62,15.66 9.38,14.42 IC302.21_PA13
  other vias: 10.61,15.77
USER-LED-CTD
  Top 0.25: R102.2 9.02,7.52 LED101.1

### Text on the board
Top: GND | GND | GND | GND
Route2: GND | GND | GND | GND
Route15: GND | GND | GND | GND
Bottom: GND | GND | GND | GND
tPlace: GND | BAT+ | H | L | LED
bPlace: LED
tNames: AND | CAN | CTD
bNames: AND | CTD
tStop: MJ-808 clone / ejovrh rev. 5